# Altium schematic sheet UART_Interface.SchDoc
size A4; SheetNumber: 7; SheetTotal: 7
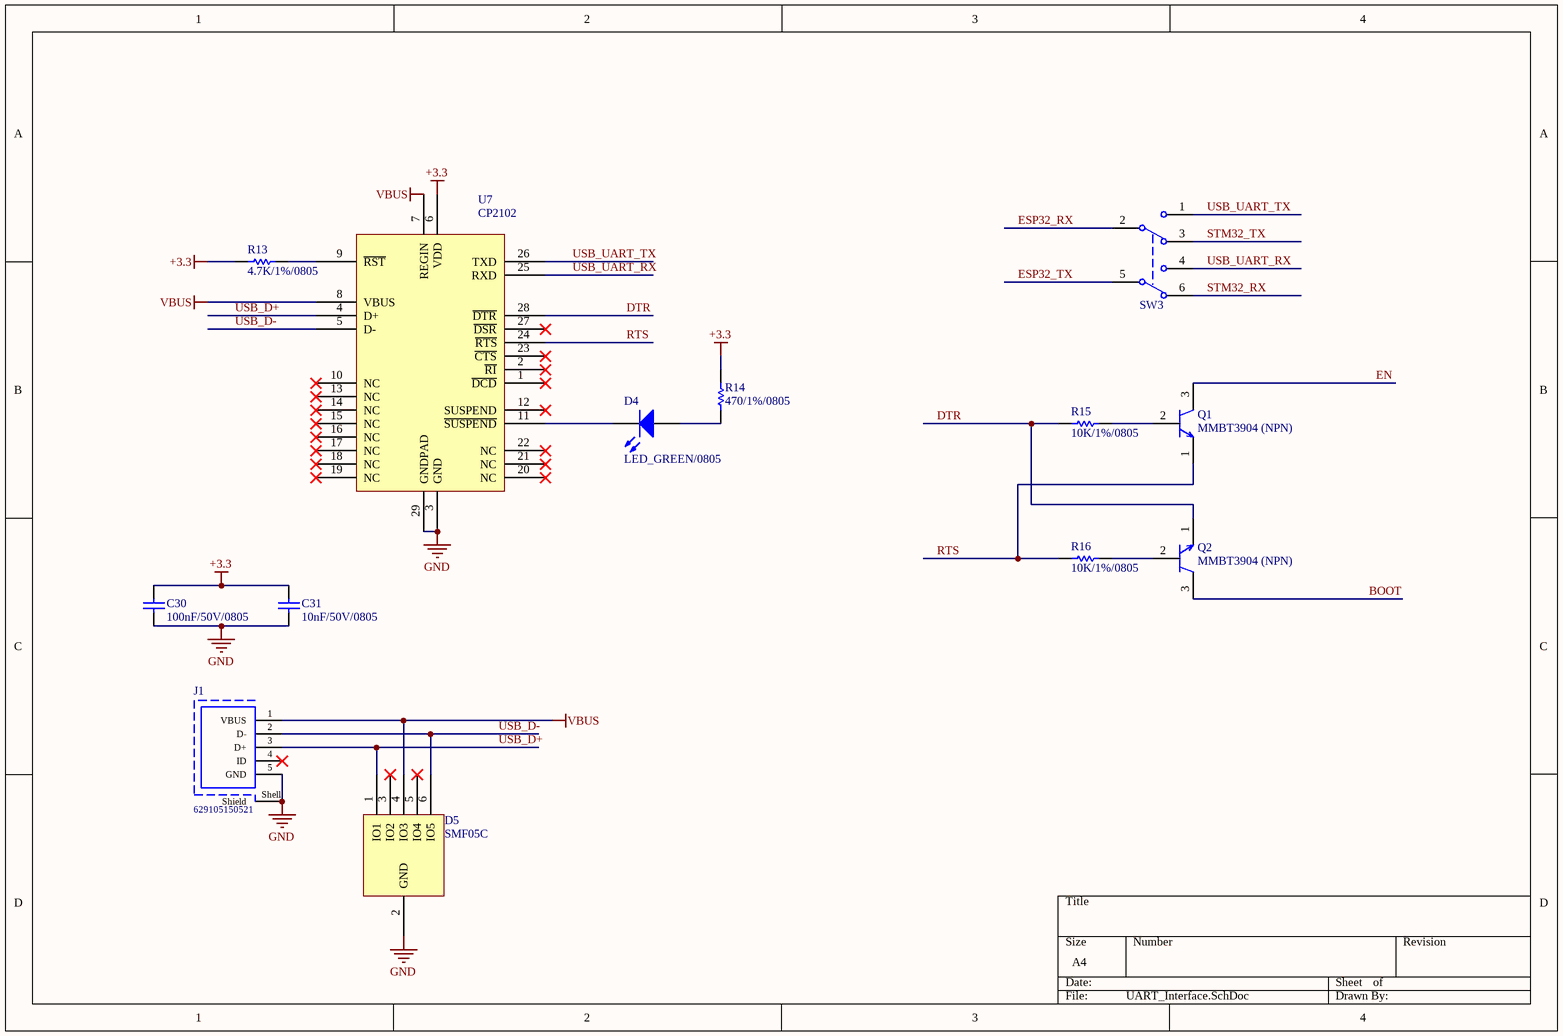
[diagram p0: UART_Interface.SchDoc]

## Parts
C30  value 100nF/50V/0805  [CAP-SM-0805]  (hidden comment: Cap Non-Pol SMD)
C31  value 10nF/50V/0805  [CAP-SM-0805]  (hidden comment: Cap Non-Pol SMD)
D4  LED_GREEN/0805  [LED_0805_Blue]
D5  SMF05C  [SOT65P210X110-6N]
J1  629105150521  [629105150521]
Q1  MMBT3904 (NPN)  [SOT95P245X110-3N]
Q2  MMBT3904 (NPN)  [SOT95P245X110-3N]
R13  value 4.7K/1%/0805  [RES-SM-0805]  (hidden comment: RESISTOR SMD)
R14  value 470/1%/0805  [RES-SM-0805]  (hidden comment: RESISTOR SMD)
R15  value 10K/1%/0805  [RES-SM-0805]  (hidden comment: RESISTOR SMD)
R16  value 10K/1%/0805  [RES-SM-0805]  (hidden comment: RESISTOR SMD)
SW3  452404020202  [452404020202]  (value not drawn)
U7  CP2102  [QFN50P500X500X90_HS-29N]

## Nets
+3.3: C30.1 C31.1 R13.2 R14.1 U7.6(VDD)
GND: C30.2 C31.2 D5.2(GND) J1.5(GND) J1.Shell(Shield) U7.3(GND) U7.29(GNDPAD)
VBUS: D5.4(IO3) J1.1(VBUS) U7.7(REGIN) U7.8(VBUS)
BOOT: Q2.3
DTR: Q2.1 R15.2 U7.28(~{DTR})
EN: Q1.3
ESP32_RX: SW3.2(COM)
ESP32_TX: SW3.5(COM)
RTS: Q1.1 R16.2 U7.24(~{RTS})
STM32_RX: SW3.6
STM32_TX: SW3.3
USB_D+: D5.1(IO1) J1.3(D+) U7.4(D+)
USB_D-: D5.6(IO5) J1.2(D-) U7.5(D-)
USB_UART_RX: SW3.4 U7.25(RXD)
USB_UART_TX: SW3.1 U7.26(TXD)
NetD4_1: D4.1(A) R14.2
NetD4_2: D4.2(K) U7.11(~{SUSPEND})
NetQ1_2: Q1.2 R15.1
NetQ2_2: Q2.2 R16.1
NetR13_1: R13.1 U7.9(~{RST})

Not connected (* = marked no-connect by the designer): D5 3(IO2)* 5(IO4)*; J1 4(ID)*; U7 1(~{DCD})* 2(~{RI})* 10(NC)* 12(SUSPEND)* 13(NC)* 14(NC)* 15(NC)* 16(NC)* 17(NC)* 18(NC)* 19(NC)* 20(NC)* 21(NC)* 22(NC)* 23(~{CTS})* 27(~{DSR})*

## Library data of the parts
C30 C31 = Cap Non-Pol SMD: Capacitor
D4 = LED SMD: LED
J1 = 629105150521: Micro USB 2.0 Type B Receptacle WR-COM, Horizontal, SMT, with Pegs, High Current at Pin 1 & Pin 5; Rated Current: 3 A; Contact Resistance: 30 mOhm; Working Voltage: 30 VAC; ComponentLink1Description: Manufacturer; ComponentLink1URL: http://www.we-online.de; ComponentLink2Description: Datasheet; ComponentLink2URL: https://katalog.we-online.de/em/datasheet/629105150521.pdf; Part Number: 629105150521; Published Date: September 2018; Publisher: Wurth Elektronik; Orientation: Horizontal; Connector Type: Micro USB 2.0 Type B; Operating Temperature: -40 to 85 degC; Mounting Technology: SMT; Gender: Receptacle; Packaging: Tape and Reel
Q1 Q2 = MMBT3904 (NPN): Manufacturer: On Semiconductor; ComponentLink1Description: Local link; ComponentLink1URL: https://www.thegioiic.com/products/mmbt3904-1am; Local supplier: thegioiic; Local supplier PN: MMBT3904-1AM; Manufacturer P/N: MMBT3904
R13-R16 = RESISTOR SMD: Resistor
SW3 = 452404020202: WS-SLTV THT Mini Slide Switch, Same Side Connection, DPDT, 6VDC, 300mA, 450g; Manufacturer: Wurth Elektronik; ComponentLink1Description: Website Link; ComponentLink1URL: https://www.we-online.com/redexpert/article/452404020202?ad; ComponentLink2Description: Datasheet Link; ComponentLink2URL: https://www.we-online.com/redexpert/spec/452404020202?ad; Manufacturer Part Number: 452404020202; Category: Slide Switches; Match Code: WS-SLTV; Mount: Through Hole; Operating Temperature Max: 85°C; Operating Temperature Min: -40°C; Packaging: Bulk; Length: 9mm; Width: 3.8mm; Height: 5.5mm; Circuit: DPDT; Contact Material: Copper Alloy; Contact Plating: Silver; Operation Force: 450g; Rated Current: 300mA; Rated Voltage: 6VDC; Terminal Material: Copper Alloy; Terminal Plating: Silver